# Altium project Joab da Silva Bezerra- PCEIoT.PrjPcb (part 1 of 2)
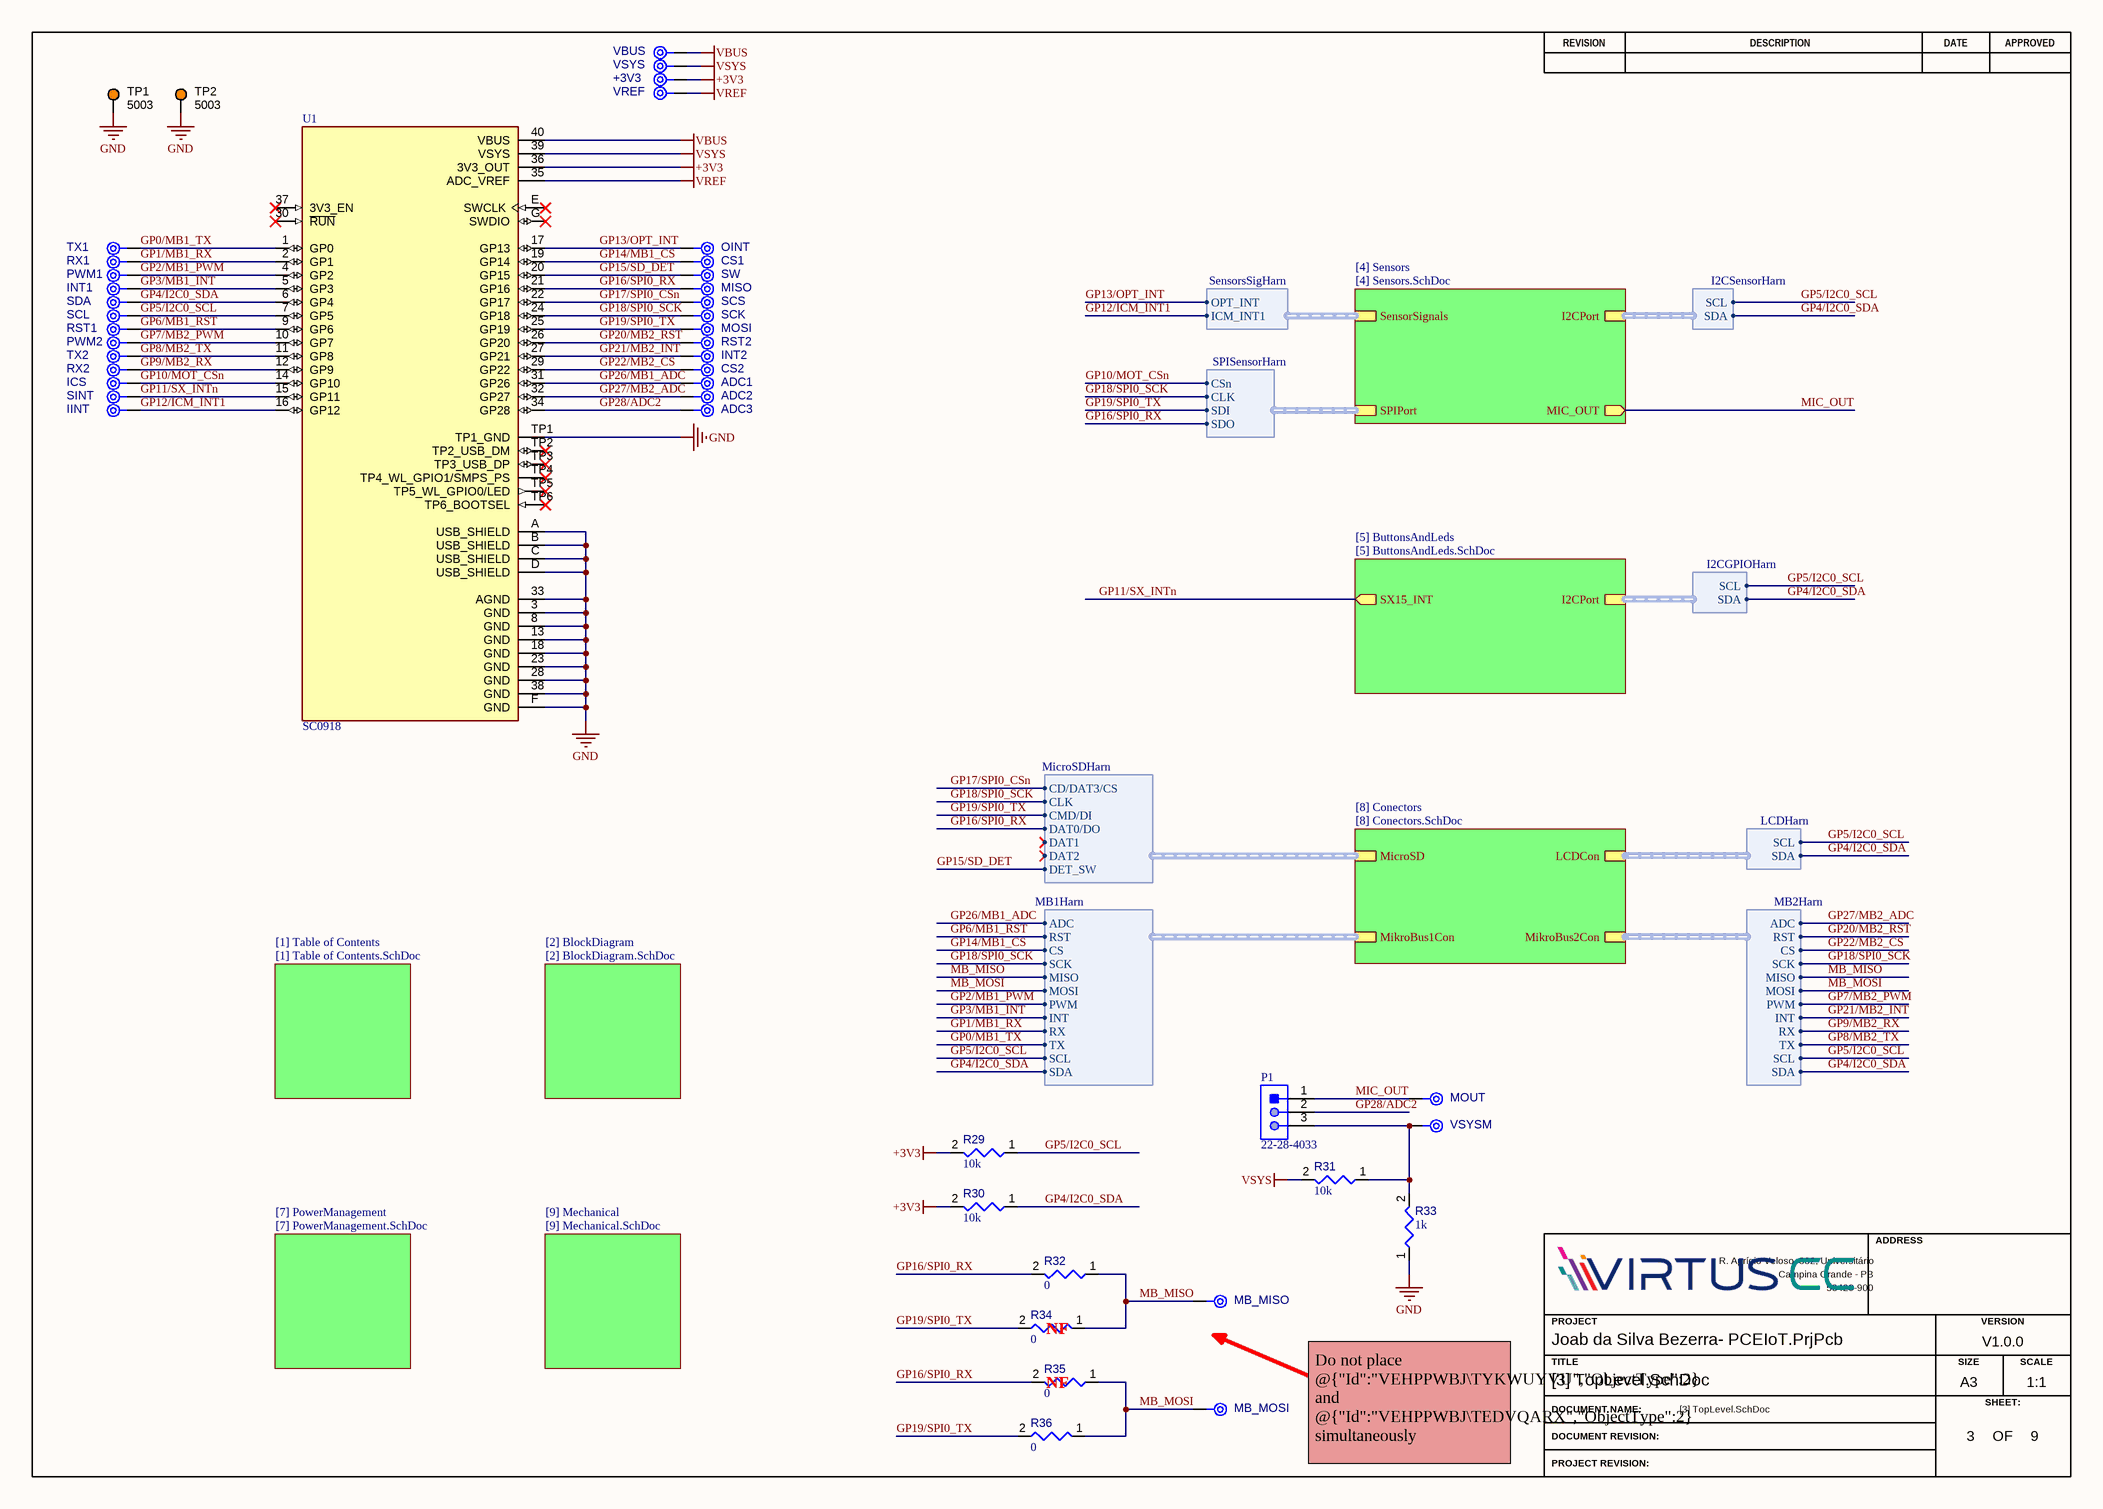
[diagram p0: [3] TopLevel.SchDoc]
Version: V1.0.0
9 sheets, 184 parts. Net scope: hierarchical (ports join the sheet entries above them; power ports are global).
Board file: PCB1.PcbDoc
Sheets:
  [3] TopLevel.SchDoc
    [1] Table of Contents = [1] Table of Contents.SchDoc
    [2] BlockDiagram = [2] BlockDiagram.SchDoc
    [7] PowerManagement = [7] PowerManagement.SchDoc
    [9] Mechanical = [9] Mechanical.SchDoc
    [4] Sensors = [4] Sensors.SchDoc
    [5] ButtonsAndLeds = [5] ButtonsAndLeds.SchDoc
      "RGB LED's"1 = [6] RgbLed.SchDoc
      "RGB LED's"2 = [6] RgbLed.SchDoc
      "RGB LED's"3 = [6] RgbLed.SchDoc
    [8] Conectors = [8] Conectors.SchDoc

## Sheet [3] TopLevel.SchDoc: =DocumentName
size A3; Organization: ORGANIZATION; Address1: R. Aprígio Veloso, 882, Universitário; Address2: Campina Grande - PB; Address3: 58429-900; DocumentNumber: 3; Revision: -; SheetNumber: 3; SheetTotal: 9; Project: Joab da Silva Bezerra- PCEIoT.PrjPcb; ENG_DATE: --/--/--; DSN_DATE: --/--/--; CHK_DATE: --/--/--; SCH_SCALE: 1:1

### Parts
+3V3  TPAD6R  [TP06R]  (value not drawn)  (no BOM)
ADC1  TPAD6R  [TP06R]  (value not drawn)  (no BOM)
ADC2  TPAD6R  [TP06R]  (value not drawn)  (no BOM)
ADC3  TPAD6R  [TP06R]  (value not drawn)  (no BOM)
CS1  TPAD6R  [TP06R]  (value not drawn)  (no BOM)
CS2  TPAD6R  [TP06R]  (value not drawn)  (no BOM)
ICS  TPAD6R  [TP06R]  (value not drawn)  (no BOM)
IINT  TPAD6R  [TP06R]  (value not drawn)  (no BOM)
INT1  TPAD6R  [TP06R]  (value not drawn)  (no BOM)
INT2  TPAD6R  [TP06R]  (value not drawn)  (no BOM)
MB_MISO  TPAD6R  [TP06R]  (value not drawn)  (no BOM)
MB_MOSI  TPAD6R  [TP06R]  (value not drawn)  (no BOM)
MISO  TPAD6R  [TP06R]  (value not drawn)  (no BOM)
MOSI  TPAD6R  [TP06R]  (value not drawn)  (no BOM)
MOUT  TPAD6R  [TP06R]  (value not drawn)  (no BOM)
OINT  TPAD6R  [TP06R]  (value not drawn)  (no BOM)
P1  22-28-4033  [MOLX-22-28-4033_V]
PWM1  TPAD6R  [TP06R]  (value not drawn)  (no BOM)
PWM2  TPAD6R  [TP06R]  (value not drawn)  (no BOM)
R29  value 10k  [RESC0603(1608)_L]  (hidden comment: Resistor 10k +/-1% 0603 100 mW)
R30  value 10k  [RESC0603(1608)_L]  (hidden comment: Resistor 10k +/-1% 0603 100 mW)
R31  value 10k  [RESC0603(1608)_L]  (hidden comment: Resistor 10k +/-1% 0603 100 mW)
R32  value 0  [RESC0603(1608)_L]  (hidden comment: Resistor 0R +/- 5% 0603 100 mW)
R33  value 1k  [RESC0603(1608)_L]  (hidden comment: Resistor 1k +/-1% 0603 100 mW)
R34  value 0  [RESC0603(1608)_L]  (hidden comment: Resistor 0R +/- 5% 0603 100 mW)
R35  value 0  [RESC0603(1608)_L]  (hidden comment: Resistor 0R +/- 5% 0603 100 mW)
R36  value 0  [RESC0603(1608)_L]  (hidden comment: Resistor 0R +/- 5% 0603 100 mW)
RST1  TPAD6R  [TP06R]  (value not drawn)  (no BOM)
RST2  TPAD6R  [TP06R]  (value not drawn)  (no BOM)
RX1  TPAD6R  [TP06R]  (value not drawn)  (no BOM)
RX2  TPAD6R  [TP06R]  (value not drawn)  (no BOM)
SCK  TPAD6R  [TP06R]  (value not drawn)  (no BOM)
SCL  TPAD6R  [TP06R]  (value not drawn)  (no BOM)
SCS  TPAD6R  [TP06R]  (value not drawn)  (no BOM)
SDA  TPAD6R  [TP06R]  (value not drawn)  (no BOM)
SINT  TPAD6R  [TP06R]  (value not drawn)  (no BOM)
SW  TPAD6R  [TP06R]  (value not drawn)  (no BOM)
TP1  5003  [KSTN-5003]
TP2  5003  [KSTN-5003]
TX1  TPAD6R  [TP06R]  (value not drawn)  (no BOM)
TX2  TPAD6R  [TP06R]  (value not drawn)  (no BOM)
U1  SC0918  [MODULE_SC0918]
VBUS  TPAD6R  [TP06R]  (value not drawn)  (no BOM)
VREF  TPAD6R  [TP06R]  (value not drawn)  (no BOM)
VSYS  TPAD6R  [TP06R]  (value not drawn)  (no BOM)
VSYSM  TPAD6R  [TP06R]  (value not drawn)  (no BOM)

### Sub-sheets
[1] Table of Contents = [1] Table of Contents.SchDoc: no entries
[2] BlockDiagram = [2] BlockDiagram.SchDoc: no entries
[4] Sensors = [4] Sensors.SchDoc: I2CPort (harness I2CSensorHarn), SPIPort (harness SPISensorHarn), SensorSignals (harness SensorsSigHarn), MIC_OUT (out)
[5] ButtonsAndLeds = [5] ButtonsAndLeds.SchDoc: SX15_INT (out), I2CPort (harness I2CGPIOHarn)
[7] PowerManagement = [7] PowerManagement.SchDoc: no entries
[8] Conectors = [8] Conectors.SchDoc: MikroBus1Con (harness MB1Harn), MicroSD (harness MicroSDHarn), MikroBus2Con (harness MB2Harn), LCDCon (harness LCDHarn)
[9] Mechanical = [9] Mechanical.SchDoc: no entries

### Harnesses
I2CSensorHarn: SCL, SDA
SPISensorHarn: CSn, CLK, SDI, SDO
SensorsSigHarn: OPT_INT, ICM_INT1
I2CGPIOHarn: SCL, SDA
LCDHarn: SCL, SDA
MicroSDHarn: CD/DAT3/CS, CLK, CMD/DI, DAT0/DO, DAT1, DAT2, DET_SW
MB1Harn: ADC, RST, CS, SCK, MISO, MOSI, PWM, INT, RX, TX, SCL, SDA
MB2Harn: ADC, RST, CS, SCK, MISO, MOSI, PWM, INT, RX, TX, SCL, SDA

### Nets
+3V3: +3V3.1(TP) R29.2 R30.2 U1.36(3V3_OUT)
GND: R33.1 TP1.1 TP2.1 U1.3(GND) U1.8(GND) U1.13(GND) U1.18(GND) U1.23(GND) U1.28(GND) U1.33(AGND) U1.38(GND) U1.A(USB_SHIELD) U1.B(USB_SHIELD) U1.C(USB_SHIELD) U1.D(USB_SHIELD) U1.F(GND) U1.TP1(TP1_GND)
VBUS: U1.40(VBUS) VBUS.1(TP)
VREF: U1.35(ADC_VREF) VREF.1(TP)
VSYS: R31.2 U1.39(VSYS) VSYS.1(TP)
GP0/MB1_TX: TX1.1(TP) U1.1(GP0) ; sheet [8] Conectors/MikroBus1Con.TX
GP1/MB1_RX: RX1.1(TP) U1.2(GP1) ; sheet [8] Conectors/MikroBus1Con.RX
GP2/MB1_PWM: PWM1.1(TP) U1.4(GP2) ; sheet [8] Conectors/MikroBus1Con.PWM
GP3/MB1_INT: INT1.1(TP) U1.5(GP3) ; sheet [8] Conectors/MikroBus1Con.INT
GP4/I2C0_SDA: R30.1 SDA.1(TP) U1.6(GP4) ; sheet [4] Sensors/I2CPort.SDA, sheet [5] ButtonsAndLeds/I2CPort.SDA, sheet [8] Conectors/LCDCon.SDA, sheet [8] Conectors/MikroBus1Con.SDA, sheet [8] Conectors/MikroBus2Con.SDA
GP5/I2C0_SCL: R29.1 SCL.1(TP) U1.7(GP5) ; sheet [4] Sensors/I2CPort.SCL, sheet [5] ButtonsAndLeds/I2CPort.SCL, sheet [8] Conectors/LCDCon.SCL, sheet [8] Conectors/MikroBus1Con.SCL, sheet [8] Conectors/MikroBus2Con.SCL
GP6/MB1_RST: RST1.1(TP) U1.9(GP6) ; sheet [8] Conectors/MikroBus1Con.RST
GP7/MB2_PWM: PWM2.1(TP) U1.10(GP7) ; sheet [8] Conectors/MikroBus2Con.PWM
GP8/MB2_TX: TX2.1(TP) U1.11(GP8) ; sheet [8] Conectors/MikroBus2Con.TX
GP9/MB2_RX: RX2.1(TP) U1.12(GP9) ; sheet [8] Conectors/MikroBus2Con.RX
GP10/MOT_CSn: ICS.1(TP) U1.14(GP10) ; sheet [4] Sensors/SPIPort.CSn
GP11/SX_INTn: SINT.1(TP) U1.15(GP11) ; sheet [5] ButtonsAndLeds/SX15_INT
GP12/ICM_INT1: IINT.1(TP) U1.16(GP12) ; sheet [4] Sensors/SensorSignals.ICM_INT1
GP13/OPT_INT: OINT.1(TP) U1.17(GP13) ; sheet [4] Sensors/SensorSignals.OPT_INT
GP14/MB1_CS: CS1.1(TP) U1.19(GP14) ; sheet [8] Conectors/MikroBus1Con.CS
GP15/SD_DET: SW.1(TP) U1.20(GP15) ; sheet [8] Conectors/MicroSD.DET_SW  [project net DET_SW]
GP16/SPI0_RX: MISO.1(TP) R32.2 R35.2 U1.21(GP16) ; sheet [4] Sensors/SPIPort.SDO, sheet [8] Conectors/MicroSD.DAT0/DO
GP17/SPI0_CSn: SCS.1(TP) U1.22(GP17) ; sheet [8] Conectors/MicroSD.CD/DAT3/CS  [project net CS]
GP18/SPI0_SCK: SCK.1(TP) U1.24(GP18) ; sheet [4] Sensors/SPIPort.CLK, sheet [8] Conectors/MicroSD.CLK, sheet [8] Conectors/MikroBus1Con.SCK, sheet [8] Conectors/MikroBus2Con.SCK
GP19/SPI0_TX: MOSI.1(TP) R34.2 R36.2 U1.25(GP19) ; sheet [4] Sensors/SPIPort.SDI, sheet [8] Conectors/MicroSD.CMD/DI
GP20/MB2_RST: RST2.1(TP) U1.26(GP20) ; sheet [8] Conectors/MikroBus2Con.RST
GP21/MB2_INT: INT2.1(TP) U1.27(GP21) ; sheet [8] Conectors/MikroBus2Con.INT
GP22/MB2_CS: CS2.1(TP) U1.29(GP22) ; sheet [8] Conectors/MikroBus2Con.CS
GP26/MB1_ADC: ADC1.1(TP) U1.31(GP26) ; sheet [8] Conectors/MikroBus1Con.ADC
GP27/MB2_ADC: ADC2.1(TP) U1.32(GP27) ; sheet [8] Conectors/MikroBus2Con.ADC
GP28/ADC2: ADC3.1(TP) P1.2 U1.34(GP28)
MB_MISO: MB_MISO.1(TP) R32.1 R34.1 ; sheet [8] Conectors/MikroBus1Con.MISO, sheet [8] Conectors/MikroBus2Con.MISO  [project net MB1_MISO]
MB_MOSI: MB_MOSI.1(TP) R35.1 R36.1 ; sheet [8] Conectors/MikroBus1Con.MOSI, sheet [8] Conectors/MikroBus2Con.MOSI  [project net MB1_MOSI]
MIC_OUT: MOUT.1(TP) P1.1 ; sheet [4] Sensors/MIC_OUT
NetP1_3: P1.3 R31.1 R33.2 VSYSM.1(TP)

Not connected (* = marked no-connect by the designer): U1 30(~{RUN})* 37(3V3_EN)* E(SWCLK)* G(SWDIO)* TP2(TP2_USB_DM)* TP3(TP3_USB_DP)* TP4(TP4_WL_GPIO1/SMPS_PS)* TP5(TP5_WL_GPIO0/LED)* TP6(TP6_BOOTSEL)*

### Notes on the sheet
- (near R34) NF
- (near R35) NF
- Do not place @{"Id":"VEHPPWBJ\TYKWUYVU","ObjectType":2} and @{"Id":"VEHPPWBJ\TEDVQARX","ObjectType":2}  simultaneously
  Do not place @{"Id":"VEHPPWBJ\RVHFYNCN","ObjectType":2} and @{"Id":"VEHPPWBJ\JGYLNFBT","ObjectType":2}  simultaneously
- REVISION
- DESCRIPTION
- DATE
- APPROVED
- ADDRESS
- PROJECT
- VERSION
- TITLE
- A3
- SIZE
- SCALE
- DOCUMENT NAME:
- DOCUMENT REVISION:
- OF
- SHEET:
- PROJECT REVISION:

### Library data of the parts
+3V3 ADC1-ADC3 CS1 CS2 ICS IINT INT1 INT2 MB_MISO MB_MOSI MISO MOSI MOUT OINT PWM1 PWM2 RST1 RST2 RX1 RX2 SCK SCL SCS SDA SINT SW TX1 TX2 VBUS VREF VSYS VSYSM = CMP-00028-00002-2: 0.6mm round; Pins: 1
P1 = CMP-002-00076-1: KK 254 Breakaway Header Vertical 3 Circuits 0.38um Gold Selective Plating Mating Pin 6.09mm; Pitch: 2.54mm; Number of Positions: 3; Contact Resistance: 20mR; Max Voltage Rating (AC): 250V; Current Rating: 4A; Gender: Male; Glow Wire Compliant: Non-compliant; RoHS Compliant: Yes; Contact Plating: Gold; Housing Color: Black; Housing Material: Nylon; Contact Mating Length: 0.24inch; Depth: 2.49mm; Number of Circuits: 3; Reach SVHC Compliant: Unknown; Packaging: Bulk; Max Voltage Rating (DC): 250V; Number of Rows: 1; Color: Black; Package Quantity: 1; Orientation: Straight; Number of Contacts: 3; Max Operating Temperature: 75°C; Mounting Technology: Through Hole; Min Operating Temperature: 0°C; Termination: Solder; Radiation Hardening: No; Series: KK® 42375; Contact Material: Brass,Bronze; Flammability Rating: UL94 V-0; Lead Free: Lead Free; Contact Type: Male Pin; Voltage Rating: 250V; Voltage Rating (DC): 250V
R29-R31 = CMP-009-00017-7: Chip Resistor, 10 KOhm, +/- 1%, 01 W, -55 to 155 degC, 0603 (1608 Metric); Power: 100mW; Voltage Rating: 50V; Mounting Technology: SM; Max Operating Temperature: 155°C; Case/Package: 0603; Tolerance: 1%; RoHS Compliant: True; Pins: 2; Min Operating Temperature: -55°C
R32 R34-R36 = CMP-009-00006-6: Chip Resistor, 0 Ohm, 0.1 W, -55 to 155 degC, 0603 (1608 Metric); Power: 100mW; Voltage Rating: 50V; Tolerance: 5%; Mounting Technology: SM; RoHS Compliant: True; Max Operating Temperature: 155°C; Min Operating Temperature: -55°C; Case/Package: 0603; Pins: 2
R33 = CMP-009-00014-6: Chip Resistor, 1 KOhm, +/-1%, 0.1 W, -55 to 155 degC, 0603 (1608 Metric); Power: 100mW; Tolerance: 1%; Voltage Rating: 50V; Mounting Technology: SM; Case/Package: 0603; Min Operating Temperature: -55°C; RoHS Compliant: True; Max Operating Temperature: 155°C; Pins: 2
TP1 TP2 = CMP-002-00037-2: Test Point, Orange, Height 4.6 mm, Tail Length 3 mm, 1-Pin THD, RoHS; Manufacturer: Keystone; Colour: Orange; Packaging: Bulk; Package Description: 1-Pin Through Hole Device, Dia 2.54 mm; Pins: 1; Package Reference: 5003; Datasheet Version: Jun-15; Case/Package: 5003; Mounting Technology: TH; Connector Type: TestPoint; Diameter: 2.54mm; Contact Material: Bronze; Datasheet URL: http://keyelco.com/userAssets/file/M65p56.pdf; Manufacturer URL: http://www.keyelco.com/; Package Quantity: 10; Contact Plating: Tin; RoHS Compliant: True
U1 = CMP-006-000001-6: Raspberry Pi Pico W RP2040; Pin Count: 53; MP: SC0918; Availability: In Stock; Source: SC0918.SchLib; Purchase-URL: https://pricing.snapeda.com/search/part/SC0918/?ref=eda; Price: None; MF: Raspberry Pi; Component Type: Standard; Design Item ID: SC0918; SnapEDA_Link: https://www.snapeda.com/parts/SC0918/Raspberry+Pi/view-part/?ref=snap; Check_prices: https://www.snapeda.com/parts/SC0918/Raspberry+Pi/view-part/?ref=eda; Value: *; Package: None; Manufacturer: Raspberry Pi; Manufacturer Part Number: SC0918; Component Type: Processors

## Sheet [1] Table of Contents.SchDoc: =DocumentName
size A3; Organization: ORGANIZATION; Address1: R. Aprígio Veloso, 882, Universitário; Address2: Campina Grande - PB; Address3: 58429-900; DocumentNumber: 1; Revision: -; SheetNumber: 1; SheetTotal: 9; Project: Joab da Silva Bezerra- PCEIoT.PrjPcb; ENG_DATE: --/--/--; DSN_DATE: --/--/--; CHK_DATE: --/--/--; SCH_SCALE: 1:1
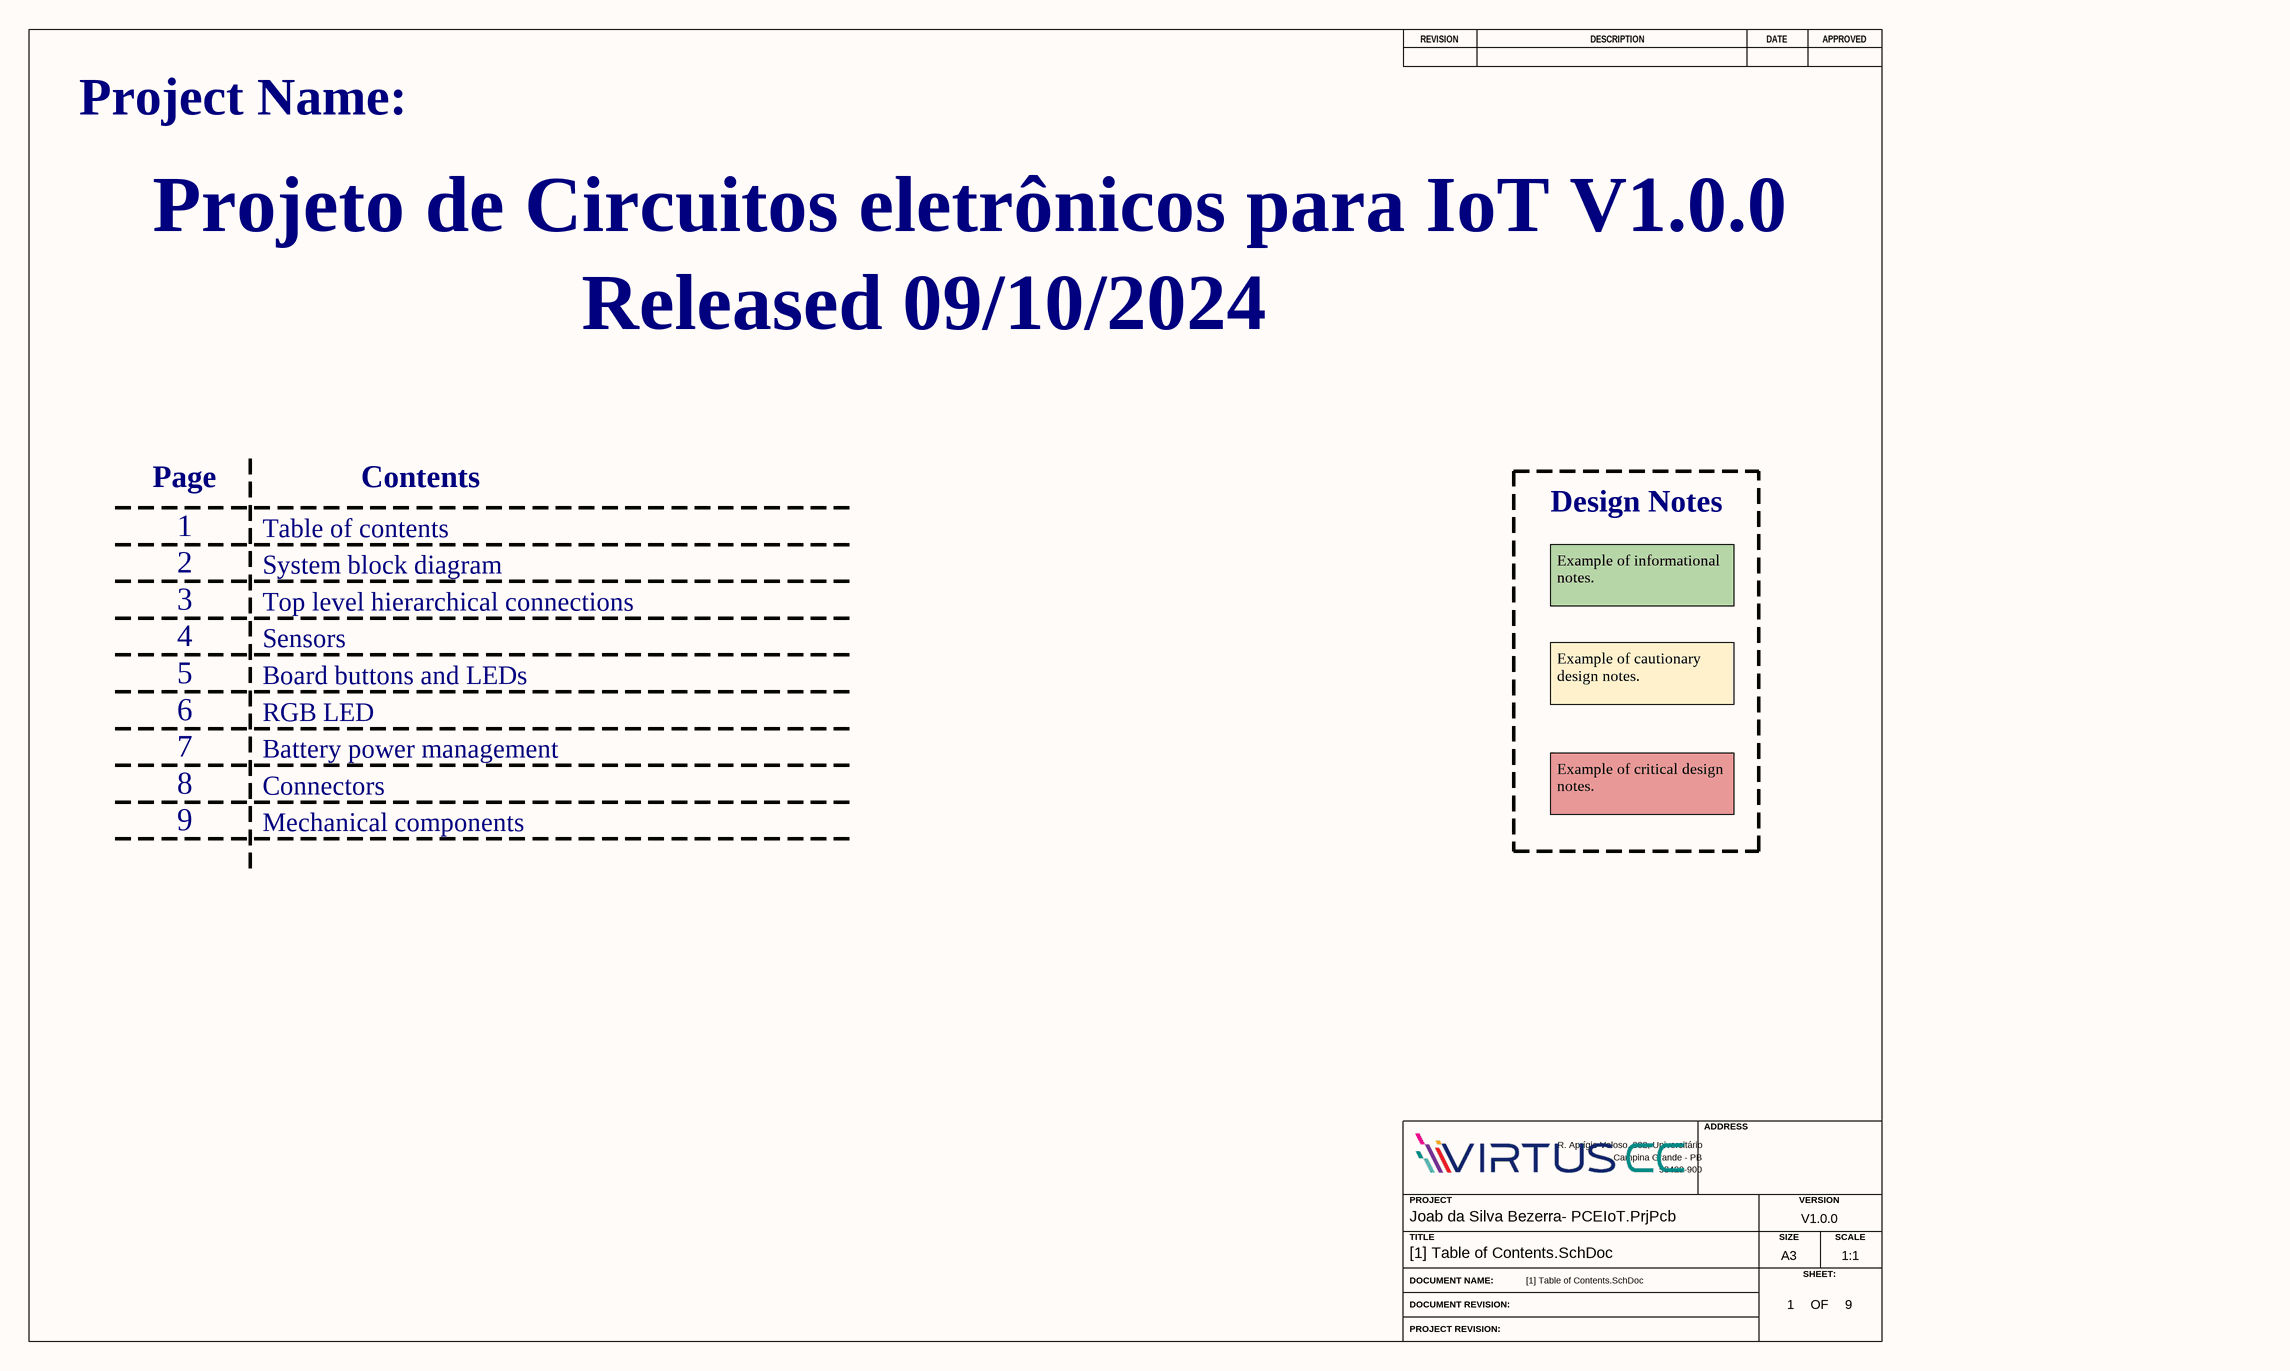
[diagram p1: [1] Table of Contents.SchDoc]

### Notes on the sheet
- Project Name:
- Projeto de Circuitos eletrônicos para IoT V1.0.0
- Released 09/10/2024
- Page
- Contents
- Design Notes
- 1
- 2
- Table of contents
- System block diagram
- 3
- 4
- Top level hierarchical connections
- Sensors
- Example of informational notes.
- 5
- Board buttons and LEDs
- Example of cautionary design notes.
- 6
- 7
- RGB LED
- Battery power management
- 8
- 9
- Connectors
- Mechanical components
- Example of critical design notes.
- REVISION
- DESCRIPTION
- DATE
- APPROVED
- ADDRESS
- PROJECT
- VERSION
- TITLE
- A3
- SIZE
- SCALE
- DOCUMENT NAME:
- DOCUMENT REVISION:
- OF
- SHEET:
- PROJECT REVISION:

## Sheet [2] BlockDiagram.SchDoc: =DocumentName
size A3; Organization: ORGANIZATION; Address1: R. Aprígio Veloso, 882, Universitário; Address2: Campina Grande - PB; Address3: 58429-900; DocumentNumber: 2; Revision: -; SheetNumber: 2; SheetTotal: 9; Project: Joab da Silva Bezerra- PCEIoT.PrjPcb; ENG_DATE: --/--/--; DSN_DATE: --/--/--; CHK_DATE: --/--/--; SCH_SCALE: 1:1
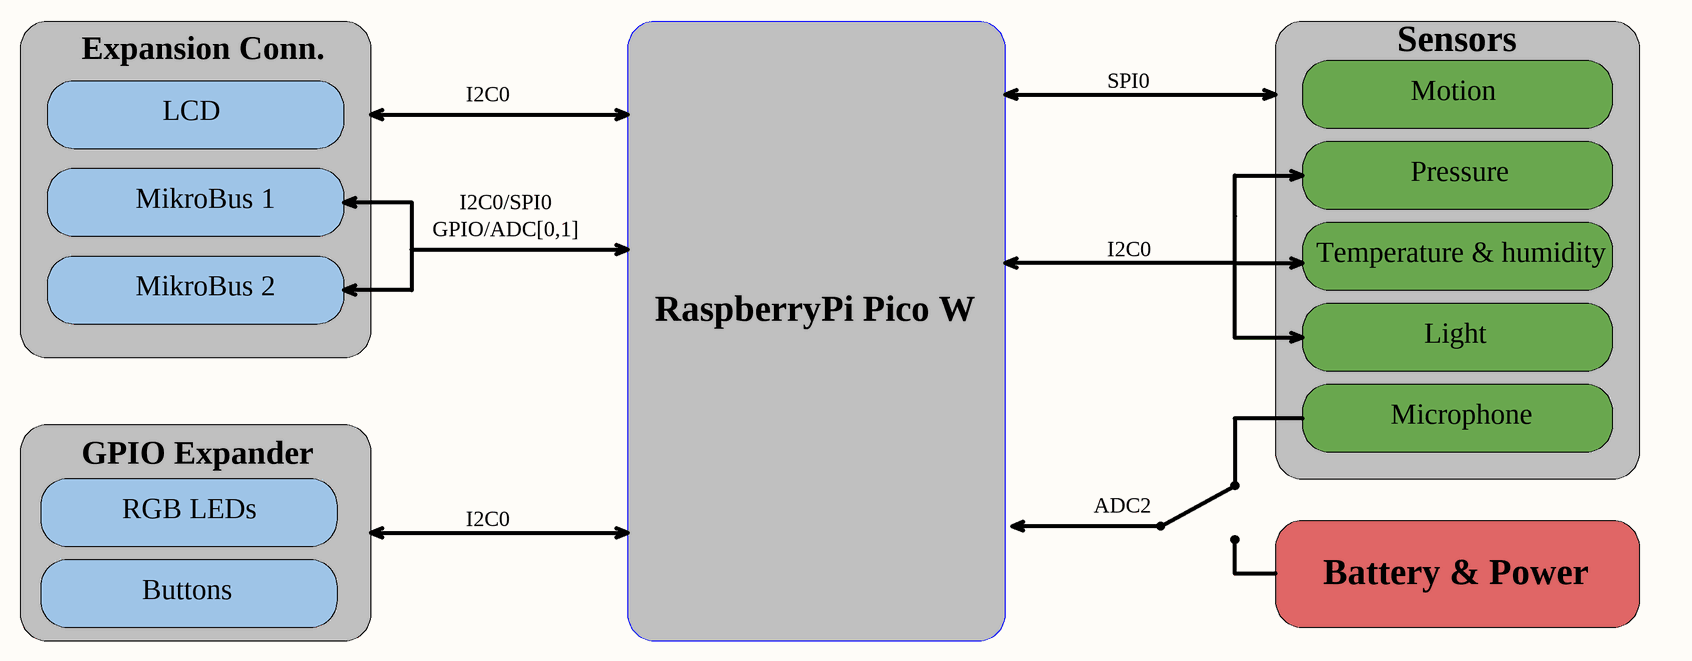
[diagram p2: [2] BlockDiagram.SchDoc]

### Notes on the sheet
- Expansion Conn.
- I2C0
- SPI0
- Sensors
- Motion
- LCD
- MikroBus 1
- GPIO/ADC[0,1]
- I2C0/SPI0
- Pressure
- MikroBus 2
- Temperature & humidity
- RaspberryPi Pico W
- Light
- Microphone
- GPIO Expander
- RGB LEDs
- ADC2
- Buttons
- Battery & Power
- REVISION
- DESCRIPTION
- DATE
- APPROVED
- ADDRESS
- PROJECT
- VERSION
- TITLE
- A3
- SIZE
- SCALE
- DOCUMENT NAME:
- DOCUMENT REVISION:
- OF
- SHEET:
- PROJECT REVISION:

## Sheet [7] PowerManagement.SchDoc: =DocumentName
size A3; Organization: ORGANIZATION; Address1: R. Aprígio Veloso, 882, Universitário; Address2: Campina Grande - PB; Address3: 58429-900; DocumentNumber: 7; Revision: -; SheetNumber: 7; SheetTotal: 9; Project: Joab da Silva Bezerra- PCEIoT.PrjPcb; ENG_DATE: --/--/--; DSN_DATE: --/--/--; CHK_DATE: --/--/--; SCH_SCALE: 1:1
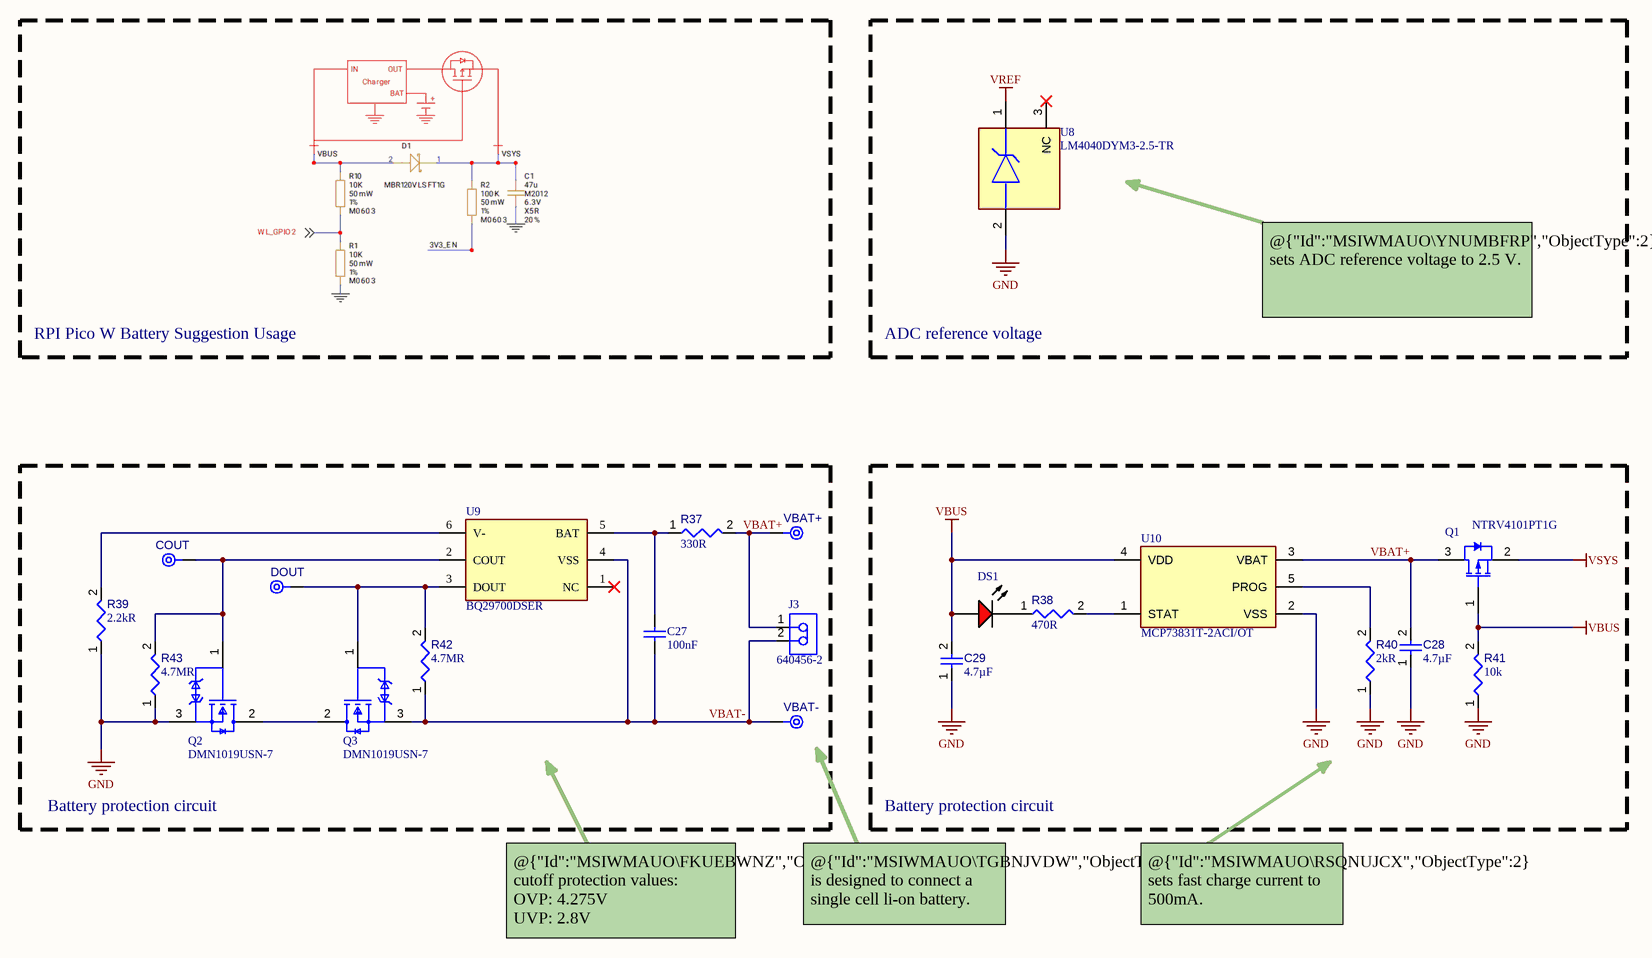
[diagram p3: [7] PowerManagement.SchDoc]

### Parts
C27  value 100nF  [CAPC0603(1608)100_L]  (hidden comment: VJ0603Y104MXJCW1BC)
C28  value 4.7µF  [CAPC0603(1608)100_L]  (hidden comment: Capacitor 4.7µF +/-20% 10V 0603)
C29  value 4.7µF  [CAPC0603(1608)100_L]  (hidden comment: Capacitor 4.7µF +/-20% 10V 0603)
COUT  TPAD6R  [TP06R]  (value not drawn)  (no BOM)
DOUT  TPAD6R  [TP06R]  (value not drawn)  (no BOM)
DS1  19-217/R6C-AL1M2VY/3T  [EVRL-0603-2_V]  (value not drawn)
J3  640456-2  [TECO-640456-2_V]
Q1  NTRV4101PT1G  [ONSC-SOT-23-3-318-08_V]
Q2  DMN1019USN-7  [FP-SC59-MFG]
Q3  DMN1019USN-7  [FP-SC59-MFG]
R37  value 330R  [RESC0603(1608)_L]  (hidden comment: ERJ-3EKF3300V)
R38  value 470R  [RESC0603(1608)_L]  (hidden comment: CRCW0603470RJNEA)
R39  value 2.2kR  [RESC0603(1608)_L]  (hidden comment: CRCW06032K20FKEA)
R40  value 2kR  [RESC0603(1608)_L]  (hidden comment: ERJ-3EKF2001V)
R41  value 10k  [RESC0603(1608)_L]  (hidden comment: Resistor 10k +/-1% 0603 100 mW)
R42  value 4.7MR  [RESC0603(1608)_L]  (hidden comment: ERJ-3GEYJ475V)
R43  value 4.7MR  [RESC0603(1608)_L]  (hidden comment: ERJ-3GEYJ475V)
U8  LM4040DYM3-2.5-TR  [FP-SOT23-3LD-PL-1-IPC_A]
U9  BQ29700DSER  [FP-DSE0006A-MFG]
U10  MCP73831T-2ACI/OT  [FP-C04-091-OT-MFG]
VBAT+  TPAD6R  [TP06R]  (value not drawn)  (no BOM)
VBAT-  TPAD6R  [TP06R]  (value not drawn)  (no BOM)

### Blocks framed on the sheet
ADC reference voltage: U8

### Nets
GND: C28.1 C29.1 Q2.3(D) R39.1 R40.1 R41.1 R43.1 U8.2(-) U10.2(VSS)
VBUS: C29.2 DS1.1(A) Q1.1(G) R41.2 U10.4(VDD)
VREF: U8.1(+)
VSYS: Q1.2(S)
VBAT+: C28.2 J3.1 Q1.3(D) R37.2 U10.3(VBAT) VBAT+.1(TP)
VBAT-: C27.1 J3.2 Q3.3(D) R42.1 U9.4(VSS) VBAT-.1(TP)
NetC27_2: C27.2 R37.1 U9.5(BAT)
NetCOUT_1: COUT.1(TP) Q2.1(G) R43.2 U9.2(COUT)
NetDOUT_1: DOUT.1(TP) Q3.1(G) R42.2 U9.3(DOUT)
NetDS1_2: DS1.2(K) R38.1
NetQ2_2: Q2.2(S) Q3.2(S)
NetR38_2: R38.2 U10.1(STAT)
NetR39_2: R39.2 U9.6(V-)
NetR40_2: R40.2 U10.5(PROG)

Not connected (* = marked no-connect by the designer): U8 3(NC)*; U9 1(NC)*

### Notes on the sheet
- RPI Pico W Battery Suggestion Usage
- @{"Id":"MSIWMAUO\YNUMBFRP","ObjectType":2} sets ADC reference voltage to 2.5 V.
- Battery protection circuit
- @{"Id":"MSIWMAUO\FKUEBWNZ","ObjectType":2}  cutoff protection values:
  OVP: 4.275V
  UVP: 2.8V
- @{"Id":"MSIWMAUO\TGBNJVDW","ObjectType":2} is designed to connect a single cell li-on battery.
- @{"Id":"MSIWMAUO\RSQNUJCX","ObjectType":2} sets fast charge current to 500mA.
- REVISION
- DESCRIPTION
- DATE
- APPROVED
- ADDRESS
- PROJECT
- VERSION
- TITLE
- A3
- SIZE
- SCALE
- DOCUMENT NAME:
- DOCUMENT REVISION:
- OF
- SHEET:
- PROJECT REVISION:

### Library data of the parts
C27 = CMP-001-00085-1: Multilayer Ceramic Capacitor, 0.1 uF, 16 V, ± 20%, X7R, 0603 [1608 Metric]; Dielectric Material: Tantalum; Voltage Rating: 16V; Packaging: Tape and Reel; Min Operating Temperature: -55°C; Case/Package: 0603; Length: 1.6mm; Termination: SMD/SMT; Height: 0.95mm; Mounting Technology: Surface Mount; Width: 0.8mm; Case Code (Imperial): 0603; Construction: Flat; Lead Free: Lead Free; Package Quantity: 4000; Max Operating Temperature: 125°C; Dielectric: X7R; RoHS Compliant: Yes; Depth: 0.8mm; Tolerance: 20%; Series: VJ; Case Code (Metric): 1608; Voltage Rating (DC): 16V
C28 C29 = CMP-001-00076-4: Chip Capacitor, 4.7µF +/-20%, 10V, 0603, Thickness 1 mm; Tolerance: 10%; Mounting Technology: SMT; Case/Package: 0603; Pins: 2; Min Operating Temperature: -55°C; Max Operating Temperature: 85°C; Voltage Rating: 10V
COUT DOUT VBAT+ VBAT- = CMP-00028-00002-2: 0.6mm round; Pins: 1
DS1 = CMP-007-00004-2: Chip LED, Red, 5 V, 25 mA, -40 to 85 degC, 2-Pin SMD (0603), RoHS, Tape and Reel; Manufacturer: Everlight Electronics; Forward Voltage: 2.2V; Lens Style: Clear; Package Reference: 0603; Datasheet Version: Rev. 1, 01/2005; Mounting Technology: SM; RoHS Compliant: False; Datasheet URL: https://datasheet.ciiva.com/4688/el-19-217-r6c-al1m2vy-3tpdf-187026-4688713.pdf; Case/Package: 0603; Colour: Red; Manufacturer URL: http://www.everlight.com/; Package Description: 2-Pin Surface Mount Device, Body 1.6 x 0.8 mm
J3 = CMP-002-00073-1: Connector 250V AC/DC 5A 2P 1 Row PCB - Vertical Mounting Polyester White; Contact Retention: No (Without); PCB Thickness: 0.063inch; Approvals: CSA; Contact Post Length: 3.56mm; Gender: Male; Circuit Application: Signal; Tail Length: 0.14inch; Plating Thickness: 3.81um; Plating: Tin; Mating Connector Lock: Yes (With); PCB Mount Retention: Without; Contact Style: Straight; Number of Positions: 2; Connector System: Wire-to-Board; Pitch: 2.54mm; Connector Type: Connector,Pin,Plug,Header; Voltage Rating: 250V; Termination: Solder; Contact Current Rating: 5A; PCB Mount Alignment: No (Without); Housing Material: Polyester; Contact Material: Copper Alloy; Current Rating: 5A; Mounting Ears: No (Without); Strain Relief: No (Without); Shrouded: No (Without); Min Operating Temperature: -67°C; Orientation: Straight; Series: MTA-100; Panel Mount Retention: No (Without); Package Quantity: 5000; Height: 7.87mm; Length: 7.62mm; PCB Mounting Orientation: Vertical; Flammability Rating: UL94 V-0; Operating Supply Voltage: 250V; Contact Plating: Tin; Mounting Technology: Through Hole; Voltage Rating (AC): 250V; Backwall/Post Interruptions: No (Without); Contact Mating Length: 7.49mm; Color: Beige; Voltage Rating (DC): 250V; Lead Free: Lead Free; Reach SVHC Compliant: Unknown; Sealable: No (Without); Mating Alignment: No (Without); Mating Retention: No (Without); Number of Contacts: 2; Contact Shape: Square; Max Operating Temperature: 221°C; Number of Rows: 1; RoHS Compliant: Yes; Housing Color: Natural
Q1 = CMP-013-00034-1: NTRV4101PT1G P-channel MOSFET Transistor; 1.7 A; 20 V; 3-Pin SOT-23; Gate to Source Voltage (Vgs): 8V; Continuous Drain Current (ID): 3.2A; Input Capacitance: 675pF; Turn-On Delay Time: 7.5ns; Rds On Max: 85mR; Power Dissipation: 1.25W; Rise Time: 12.6ns; Max Power Dissipation: 420mW; Drain to Source Resistance: 70mR; Element Configuration: Single; Turn-Off Delay Time: 30.2ns; Fall Time: 21ns; Drain to Source Voltage (Vdss): 20V; Number of Elements: 1; Case/Package: SOT-23-3; RoHS Compliant: Yes; Polarity: P-CHANNEL; Height: 1.01mm; Packaging: Tape and Reel; Series: -; Package Quantity: 3000; Max Operating Temperature: 150°C; Length: 3.04mm; Lead Free: Lead Free; Pins: 3; Radiation Hardening: No; Width: 1.4mm; Min Operating Temperature: -55°C
Q2 Q3 = CMP-013-00035-1: N-Channel 12 V 10 mO 50.6 nC SMT Enhancement Mode Mosfet - SC-59 (SOT-23); Gate to Source Voltage (Vgs): 4.5V; Max Power Dissipation: 680mW; Number of Channels: 1; Rds On Max: 10mR; Input Capacitance: 2.426nF; Turn-On Delay Time: 7.6ns; Value: 2.426E-09F; Rise Time: 57.6ns; Fall Time: 16.8ns; Drain to Source Resistance: 41mR; Turn-Off Delay Time: 22.2ns; Continuous Drain Current (ID): 9.3A; Drain to Source Voltage (Vdss): 12V; RoHS Compliant: Yes; Min Operating Temperature: -55°C; Series: -; Max Operating Temperature: 150°C; Lead Free: Lead Free; Weight: 0.000282oz; Package Quantity: 3000; Polarity: N-CHANNEL; Packaging: Tape and Reel; Case/Package: TO-236-3; Mounting Technology: Surface Mount
R37 = CMP-009-00184-1: SMD Chip Resistor, 330 Ohm, ± 1%, 100 mW, 0603 [1608 Metric], Thick Film, Precision; Current Rating: 500mA; Voltage Rating (DC): 75V; Power Rating: 100mW; Gender: Male; Temperature Coefficient: 100ppm/°C; Termination: SMD/SMT; Construction: Rectangular; Contact Plating: Tin; Resistor Type: Thick Film; Features: Automotive AEC-Q200; Max Operating Temperature: 155°C; Weight: 7.1E-05oz; Package Quantity: 5000; Lead Pitch: 1.1mm; Radiation Hardening: No; Lead Free: Lead Free; Min Operating Temperature: -55°C; Reach SVHC Compliant: No; Pins: 2; Number of Terminations: 2; Width: 0.8mm; RoHS Compliant: Yes; Depth: 0.8mm; Packaging: Tape and Reel; Voltage Rating: 75V; Mounting Technology: Surface Mount; Case Code (Metric): 1608; Resistance Tolerance: 1%; Tolerance: 1%; Case Code (Imperial): 0603; Length: 1.6mm; Height: 0.45mm; Military Standard: Not; Series: ERJ; Max Power Dissipation: 100mW; Case/Package: 0603; Contact Material: Copper
R38 = CMP-009-00182-1: Res Thick Film 0603 470 Ohm 5% 0.1W(1/10W) ±200ppm/°C Pad SMD Automotive T/R; Max Power Dissipation: 100mW; Working Voltage: 75V; Case Code (Metric): 1608; Case Code (Imperial): 0603; Width: 0.85mm; Series: CRCW; Max Operating Temperature: 155°C; Features: Automotive AEC-Q200; Height: 0.45mm; Technology: THICK FILM; Power Rating: 100mW; Depth: 0.85mm; Min Operating Temperature: -55°C; Weight: 7.1E-05oz; RoHS Compliant: Yes; Number of Terminations: 2; Voltage Rating: 75V; Ratings: AEC-Q200; Case/Package: 0603; Contact Plating: Tin; Radiation Hardening: No; Termination: SMD/SMT; Tolerance: 5%; Construction: Rectangular; Package Quantity: 5000; Reach SVHC Compliant: Unknown; Length: 1.55mm; Resistor Type: Thick Film; Lead Free: Lead Free; Temperature Coefficient: 200ppm/°C; Resistance Tolerance: 5%; Packaging: Tape and Reel; Military Standard: Not
R39 = CMP-009-00186-1: SMD Chip Resistor, 2.2 kOhm, ± 1%, 100 mW, 0603 [1608 Metric], Thick Film, General Purpose; Voltage Rating (DC): 75V; Max Power Dissipation: 100mW; Temperature Coefficient: 100ppm/°C; Depth: 0.85mm; Height: 0.45mm; Contact Plating: Tin; Resistance Tolerance: 1%; Ratings: AEC-Q200; Weight: 7.1E-05oz; Series: CRCW; Case Code (Imperial): 0603; Construction: Rectangular; Width: 0.033inch; Reach SVHC Compliant: Unknown; Case Code (Metric): 1608; Resistor Type: Thick Film; Packaging: Tape and Reel; Case/Package: 0603; Package Quantity: 10; RoHS Compliant: Yes; Lead Free: Lead Free; Military Standard: Not; Termination: SMD/SMT; Tolerance: 1%; Technology: THICK FILM; Max Operating Temperature: 155°C; Voltage Rating: 75V; Power Rating: 100mW; Length: 1.55mm; Number of Terminations: 2; Radiation Hardening: No; Min Operating Temperature: -55°C; Features: Automotive AEC-Q200
R40 = CMP-009-00181-1: SMD Chip Resistor, 2 kOhm, ï¿½ 1%, 100 mW, 0603 [1608 Metric], Thick Film, Precision; Power Rating: 100mW; Temperature Coefficient: 100ppm/°C; Voltage Rating: 75V; Voltage Rating (DC): 50V; Construction: Rectangular; Tolerance: 1%; Case Code (Imperial): 0603; Contact Plating: Tin; Packaging: Tape and Reel; Width: 0.8mm; Length: 1.6mm; Lead Free: Lead Free; Max Operating Temperature: 155°C; Number of Terminations: 2; Features: Automotive AEC-Q200; Min Operating Temperature: -55°C; Termination: SMD/SMT; Case/Package: 0603; Max Power Dissipation: 100mW; Reach SVHC Compliant: No; Radiation Hardening: No; RoHS Compliant: Yes; Resistance Tolerance: 1%; Pins: 2; Series: ERJ; Case Code (Metric): 1608; Mounting Technology: Surface Mount; Height: 0.022inch; Military Standard: Not; Depth: 0.8mm; Package Quantity: 1; Resistor Type: Thick Film
R41 = CMP-009-00017-7: as R29 on sheet [3] TopLevel; Mounting Technology: SM; Max Operating Temperature: 155°C; Case/Package: 0603; Tolerance: 1%; RoHS Compliant: True; Pins: 2; Min Operating Temperature: -55°C
R42 R43 = CMP-009-00185-1: Res Thick Film 0603 4.7M Ohm 5% 0.1W -400ppm/°C to 150ppm/°C Molded SMD Punched Carrier T/R; Voltage Rating (DC): 50V; Max Power Dissipation: 100mW; Voltage Rating: 75V; Min Operating Temperature: -55°C; Reach SVHC Compliant: Unknown; Resistance Tolerance: 5%; Contact Plating: Tin; Military Standard: Not; RoHS Compliant: Yes; Tolerance: 5%; Depth: 0.8mm; Case/Package: 0603; Number of Terminations: 2; Width: 0.8mm; Lead Free: Lead Free; Case Code (Metric): 1608; Construction: Rectangular; Series: ERJ; Features: Automotive AEC-Q200; Length: 1.6mm; Power Rating: 100mW; Weight: 7.1E-05oz; Termination: SMD/SMT; Height: 0.45mm; Resistor Type: Thick Film; Case Code (Imperial): 0603; Packaging: Tape and Reel; Mounting Technology: Surface Mount; Temperature Coefficient: 150ppm/°C; Package Quantity: 1; Technology: THICK FILM; Max Operating Temperature: 155°C
U8 = CMP-004-00033-1: LM4040 Series 2.5 V ±1 % Precision Micropower Shunt Voltage Reference - SOT-23; Max Output Voltage: 2.5V; Output Type: Fixed; Output Voltage: 10V; Cathode Current: 70uA; Temperature Coefficient: 150ppm/°C; Output Current: 15mA; Tolerance: 1%; Supply Current: 500nA; Max Operating Temperature: 85°C; Series: -; Min Output Voltage: 2.5V; Length: 2.92mm; Current Rating: 15mA; Pins: 3; Height: 1.01mm; Package Quantity: 3000; Max Output current: 15mA; Min Operating Temperature: -40°C; Packaging: Tape and Reel; Width: 1.3mm; Radiation Hardening: No; Case/Package: SOT-23; Reach SVHC Compliant: No; Reference Voltage: 2.5V; Lead Free: Lead Free; RoHS Compliant: Yes; Reference Type: Shunt; Mounting Technology: Surface Mount
U9 = CMP-001-0002-1: Li-Ion/Li Polymer Advanced Single-Cell Battery Protector IC Family 6-WSON -40 to 85; Fault Protection: Over Current,Short Circuit,Over/Under Voltage; Operating Supply Voltage: 8V; Number of Cells: 1; Case/Package: WFDFN; Lead Free: Lead Free; Pins: 6; Height: 800um; Packaging: Tape and Reel; Max Operating Temperature: 85°C; Weight: 0.000342oz; Mounting Technology: Surface Mount; Series: -; Contact Plating: Gold; Thickness: 750um; RoHS Compliant: Yes; Package Quantity: 3000; Width: 1.5mm; Length: 1.5mm; Min Operating Temperature: -40°C
U10 = CMP-001-0001-1: MCP73831 Series Single-Cell Li-Ion/Li-Polymer Battery Charge Controller SOT-23-5; Output Voltage: 4.2V; Number of Channels: 1; Fault Protection: Over Voltage; Min Supply Voltage: 3.75V; Max Supply Voltage: 6V; Max Power Dissipation: 1.54W; Output Current: 500mA; Voltage Rating: 4.534V; Drain to Source Resistance: 350mR; Min Output Voltage: 4.168V; Max Output Voltage: 4.5V; Mounting Technology: Surface Mount; Number of Outputs: 1; RoHS Compliant: Yes; Weight: 0.00709oz; Length: 3.1mm; Max Operating Temperature: 85°C; Series: -; Case/Package: SOT-23; Radiation Hardening: No; Pins: 5; Packaging: Tape and Reel; Lead Free: Lead Free; Number of Cells: 1; Width: 1.8mm; Height: 1.3mm; Max Charge Current: 500mA; Battery Pack Voltage: 4.2V; Reach SVHC Compliant: No; Termination: SMD/SMT; Min Operating Temperature: -40°C

## Sheet [9] Mechanical.SchDoc: =DocumentName
size A3; Organization: ORGANIZATION; Address1: R. Aprígio Veloso, 882, Universitário; Address2: Campina Grande - PB; Address3: 58429-900; DocumentNumber: 9; Revision: -; SheetNumber: 9; SheetTotal: 9; Project: Joab da Silva Bezerra- PCEIoT.PrjPcb; ENG_DATE: --/--/--; DSN_DATE: --/--/--; CHK_DATE: --/--/--; SCH_SCALE: 1:1
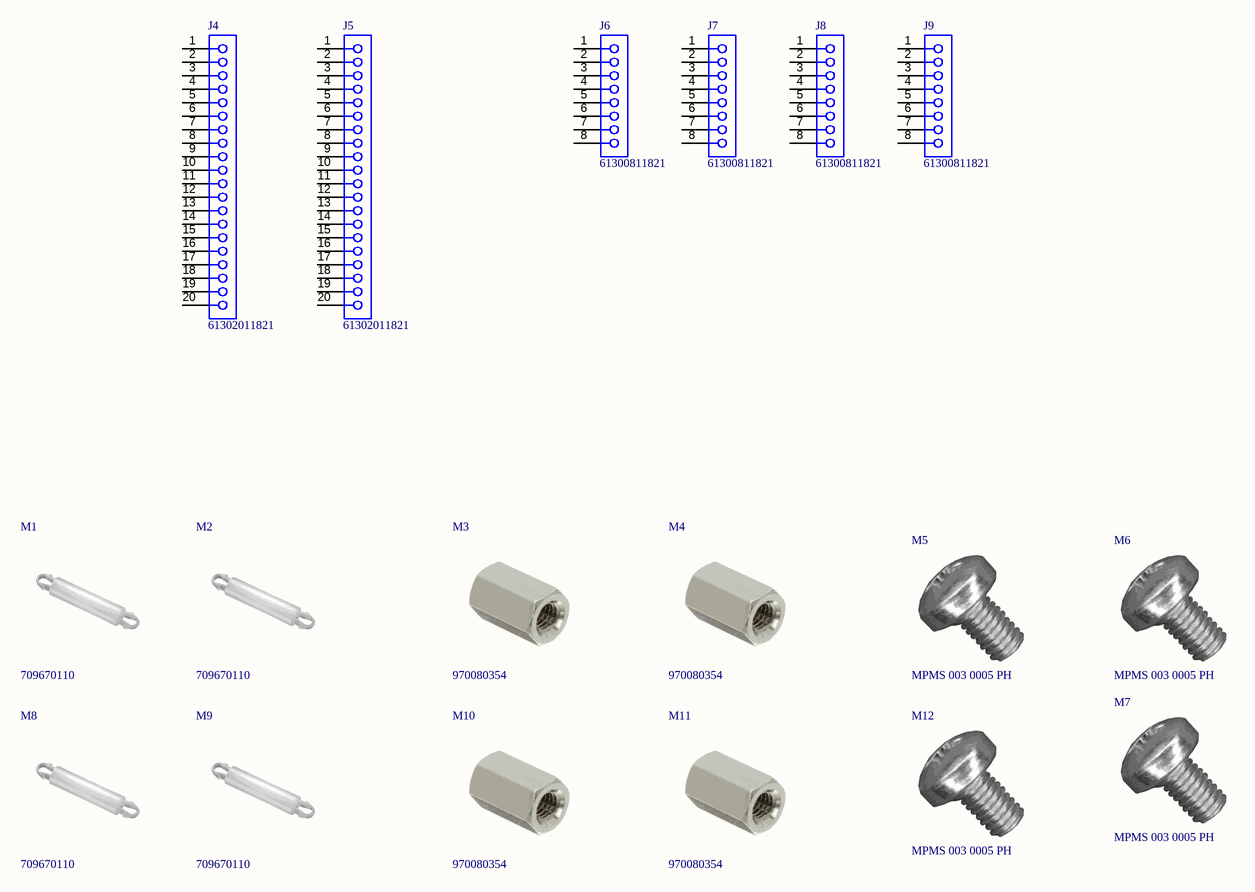
[diagram p4: [9] Mechanical.SchDoc]

### Parts
J4  61302011821  [61302011821]  (mechanical)
J5  61302011821  [61302011821]  (mechanical)
J6  61300811821  [61300811821]  (mechanical)
J7  61300811821  [61300811821]  (mechanical)
J8  61300811821  [61300811821]  (mechanical)
J9  61300811821  [61300811821]  (mechanical)
M1  709670110  (mechanical)
M2  709670110  (mechanical)
M3  970080354  (mechanical)
M4  970080354  (mechanical)
M5  MPMS 003 0005 PH  (mechanical)
M6  MPMS 003 0005 PH  (mechanical)
M7  MPMS 003 0005 PH  (mechanical)
M8  709670110  (mechanical)
M9  709670110  (mechanical)
M10  970080354  (mechanical)
M11  970080354  (mechanical)
M12  MPMS 003 0005 PH  (mechanical)

### Nets

Not connected (* = marked no-connect by the designer): J4 1 2 3 4 5 6 7 8 9 10 11 12 13 14 15 16 17 18 19 20; J5 1 2 3 4 5 6 7 8 9 10 11 12 13 14 15 16 17 18 19 20; J6 1 2 3 4 5 6 7 8; J7 1 2 3 4 5 6 7 8; J8 1 2 3 4 5 6 7 8; J9 1 2 3 4 5 6 7 8

### Notes on the sheet
- REVISION
- DESCRIPTION
- DATE
- APPROVED
- ADDRESS
- PROJECT
- VERSION
- TITLE
- A3
- SIZE
- SCALE
- DOCUMENT NAME:
- DOCUMENT REVISION:
- OF
- SHEET:
- PROJECT REVISION:

### Library data of the parts
J4 J5 = CMP-002-00074-1: THT Vertical Socket Header WR-PHD, Pitch 2.54 mm, Single Row, 20 pins; Contact Resistance: 20mR; Operating Supply Voltage: 250V; Current Rating: 3A; Gender: Female; Orientation: Vertical; Pins: 20; Lead Pitch: 2.54mm; RoHS Compliant: Yes
J6-J9 = CMP-002-00075-1: Btb Conn, Rcpt, 8Pos, 1Row, 2.54Mm Rohs Compliant: Yes; Operating Supply Voltage: 250V; Gender: Female; Contact Resistance: 20mR; Current Rating: 3A; Pins: 8; Lead Pitch: 2.54mm; Orientation: Vertical; RoHS Compliant: Yes
M1 M2 M8 M9 = CMP-00028-00009-2: Pcb Mounting, Nylon 6.6, 11Mm Rohs Compliant: Yes; Material: Nylon; Series: WA-SNSN
M3 M4 M10 M11 = CMP-00028-00008-4: WA-SBRII Brass Spacer Stud Metric Thread int./int.; Gender: Female, Female; Threaded/Unthreaded: Threaded; Thread Size: M3; Plating: Nickel; Series: WA-SBRII; Color: Silver; Material: Brass
M5-M7 M12 = CMP-00028-00007-2: Mach Screw Pan Head Phillips M3; Lead Free: Contains Lead

## Sheet [4] Sensors.SchDoc: =DocumentName
size A3; Organization: ORGANIZATION; Address1: R. Aprígio Veloso, 882, Universitário; Address2: Campina Grande - PB; Address3: 58429-900; DocumentNumber: 4; Revision: -; SheetNumber: 4; SheetTotal: 9; Project: Joab da Silva Bezerra- PCEIoT.PrjPcb; ENG_DATE: --/--/--; DSN_DATE: --/--/--; CHK_DATE: --/--/--; SCH_SCALE: 1:1
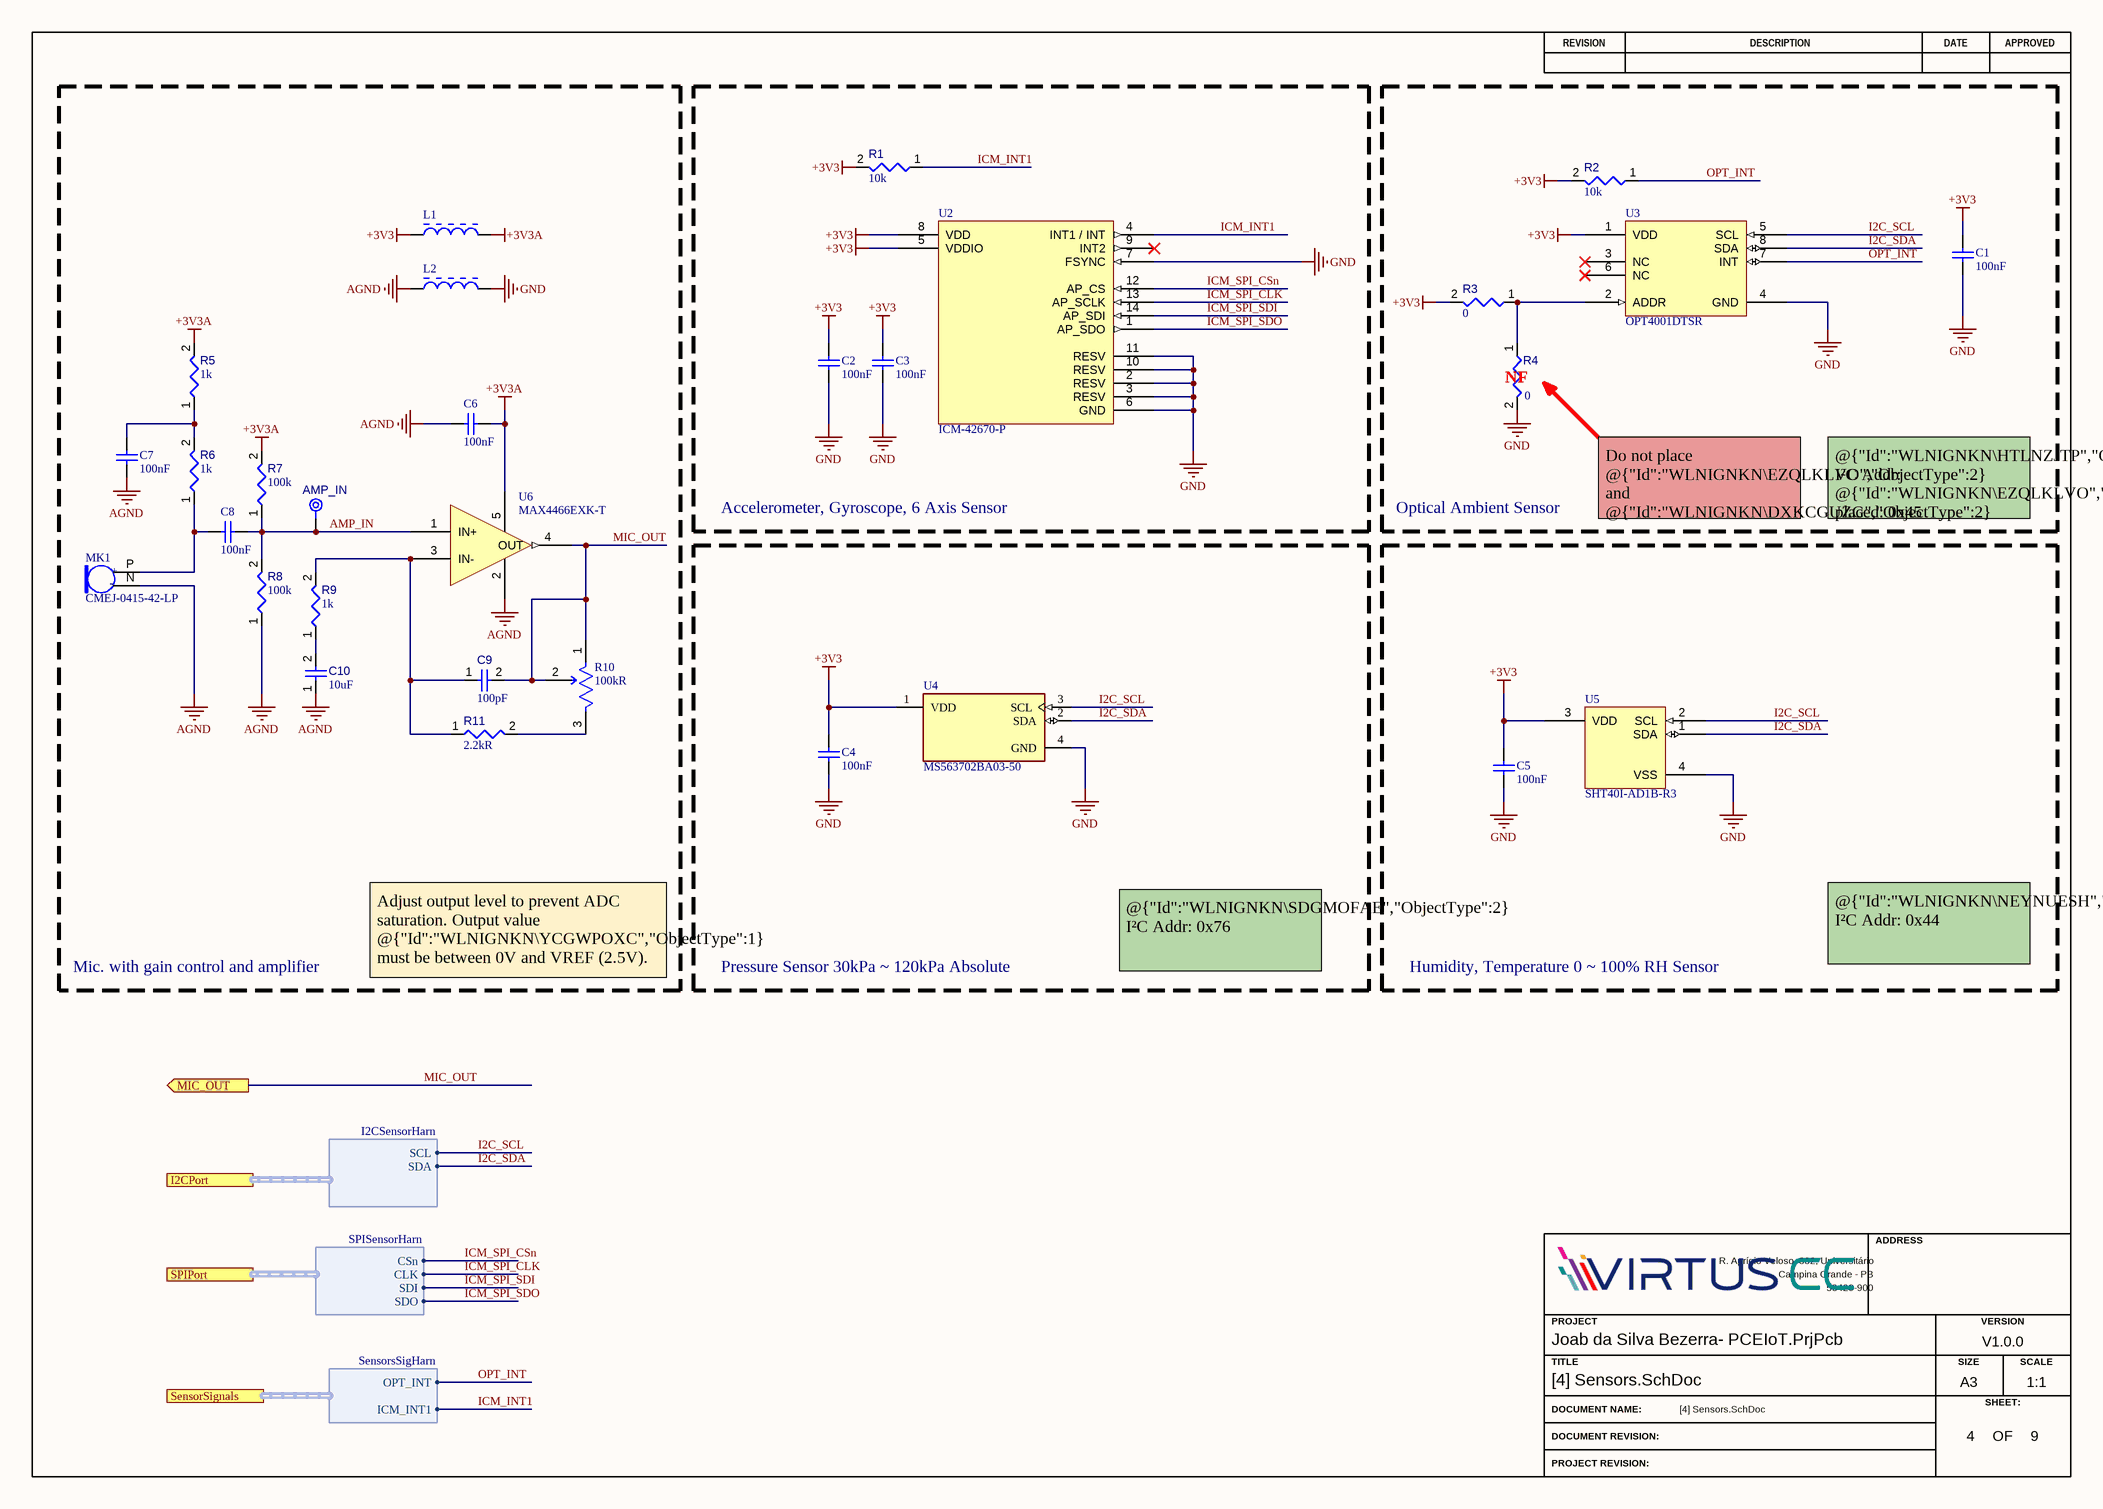
[diagram p5: [4] Sensors.SchDoc]

### Parts
AMP_IN  TPAD6R  [TP06R]  (value not drawn)  (no BOM)
C1  value 100nF  [CAPC0603(1608)100_L]  (hidden comment: VJ0603Y104MXJCW1BC)
C2  value 100nF  [CAPC0603(1608)100_L]  (hidden comment: VJ0603Y104MXJCW1BC)
C3  value 100nF  [CAPC0603(1608)100_L]  (hidden comment: VJ0603Y104MXJCW1BC)
C4  value 100nF  [CAPC0603(1608)100_L]  (hidden comment: VJ0603Y104MXJCW1BC)
C5  value 100nF  [CAPC0603(1608)100_L]  (hidden comment: VJ0603Y104MXJCW1BC)
C6  value 100nF  [CAPC0603(1608)100_L]  (hidden comment: VJ0603Y104MXJCW1BC)
C7  value 100nF  [CAPC0603(1608)100_L]  (hidden comment: VJ0603Y104MXJCW1BC)
C8  value 100nF  [CAPC0603(1608)100_L]  (hidden comment: VJ0603Y104MXJCW1BC)
C9  value 100pF  [CAPC0603(1608)100_L]  (hidden comment: C0603C101K5GACTU)
C10  value 10uF  [CAPC0603(1608)100_L]  (hidden comment: GRM188R60J106ME47D)
L1  BLM21PG331SN1D  [INDC2013X105X50ML20T20]  (value not drawn)
L2  BLM21PG331SN1D  [INDC2013X105X50ML20T20]  (value not drawn)
MK1  CMEJ-0415-42-LP  [MIC_CMEJ-0415-42-LP]
R1  value 10k  [RESC0603(1608)_L]  (hidden comment: Resistor 10k +/-1% 0603 100 mW)
R2  value 10k  [RESC0603(1608)_L]  (hidden comment: Resistor 10k +/-1% 0603 100 mW)
R3  value 0  [RESC0603(1608)_L]  (hidden comment: Resistor 0R +/- 5% 0603 100 mW)
R4  value 0  [RESC0603(1608)_L]  (hidden comment: Resistor 0R +/- 5% 0603 100 mW)
R5  value 1k  [RESC0603(1608)_L]  (hidden comment: Resistor 1k +/-1% 0603 100 mW)
R6  value 1k  [RESC0603(1608)_L]  (hidden comment: Resistor 1k +/-1% 0603 100 mW)
R7  value 100k  [RESC0603(1608)_L]  (hidden comment: Resistor 100k +/-1% 0603 100 mW)
R8  value 100k  [RESC0603(1608)_L]  (hidden comment: Resistor 100k +/-1% 0603 100 mW)
R9  value 1k  [RESC0603(1608)_L]  (hidden comment: Resistor 1k +/-1% 0603 100 mW)
R10  value 100kR  [FP-TC33X-2-MFG]  (hidden comment: TC33X-2-104E)
R11  value 2.2kR  [RESC0603(1608)_L]  (hidden comment: CRCW06032K20FKEA)
U2  ICM-42670-P  [QFN50P300X250X81-14N]
U3  OPT4001DTSR  [SON50P130X60-8N]
U4  MS563702BA03-50  [FP-MS563702BA03-50-MFG]
U5  SHT40I-AD1B-R3  [QFN80P150X150X55-4N]
U6  MAX4466EXK-T  [SOT65P200X110-5N]

### Blocks framed on the sheet
Mic. with gain control and amplifier: AMP_IN C6-C10 L1 L2 MK1 R5-R11 U6
Accelerometer, Gyroscope, 6 Axis Sensor: C2 C3 R1 U2
Pressure Sensor 30kPa ~ 120kPa Absolute: C4 U4
Humidity, Temperature 0 ~ 100% RH Sensor: C5 U5

### Ports
I2CPort (harness I2CSensorHarn, see [3] TopLevel[7A]), MIC_OUT (out, see [3] TopLevel[7B]), SensorSignals (harness SensorsSigHarn, see [3] TopLevel[6A]), SPIPort (harness SPISensorHarn, see [3] TopLevel[6B])

### Harnesses
I2CSensorHarn: SCL, SDA
SPISensorHarn: CSn, CLK, SDI, SDO
SensorsSigHarn: OPT_INT, ICM_INT1

### Nets
+3V3: C1.1 C2.1 C3.1 C4.2 C5.2 L1.1 R1.2 R2.2 R3.2 U2.5(VDDIO) U2.8(VDD) U3.1(VDD) U4.1(VDD) U5.3(VDD)
+3V3A: C6.2 L1.2 R5.2 R7.2 U6.5(VCC)
AGND: C6.1 C7.1 C10.1 L2.1 MK1.N(GND) R8.1 U6.2(GND)
GND: C1.2 C2.2 C3.2 C4.1 C5.1 L2.2 R4.2 U2.2(RESV) U2.3(RESV) U2.6(GND) U2.7(FSYNC) U2.10(RESV) U2.11(RESV) U3.4(GND) U4.4(GND) U5.4(VSS)
AMP_IN: AMP_IN.1(TP) C8.2 R7.1 R8.2 U6.1(IN+)
I2C_SCL: U3.5(SCL) U4.3(SCL) U5.2(SCL) ; port I2CPort.SCL  [project net GP5/I2C0_SCL]
I2C_SDA: U3.8(SDA) U4.2(SDA) U5.1(SDA) ; port I2CPort.SDA  [project net GP4/I2C0_SDA]
ICM_INT1: R1.1 U2.4(INT1_/_INT) ; port SensorSignals.ICM_INT1  [project net GP12/ICM_INT1]
ICM_SPI_CLK: U2.13(AP_SCLK) ; port SPIPort.CLK  [project net GP18/SPI0_SCK]
ICM_SPI_CSn: U2.12(AP_CS) ; port SPIPort.CSn  [project net GP10/MOT_CSn]
ICM_SPI_SDI: U2.14(AP_SDI) ; port SPIPort.SDI  [project net GP19/SPI0_TX]
ICM_SPI_SDO: U2.1(AP_SDO) ; port SPIPort.SDO  [project net GP16/SPI0_RX]
MIC_OUT: C9.2 R10.1(CCW) R10.2(WIPER) U6.4(OUT) ; port MIC_OUT
OPT_INT: R2.1 U3.7(INT) ; port SensorSignals.OPT_INT  [project net GP13/OPT_INT]
NetC7_2: C7.2 R5.1 R6.2
NetC8_1: C8.1 MK1.P(OUTPUT) R6.1
NetC9_1: C9.1 R9.2 R11.1 U6.3(IN-)
NetC10_2: C10.2 R9.1
NetR3_1: R3.1 R4.1 U3.2(ADDR)
NetR10_3: R10.3(CW) R11.2

Not connected (* = marked no-connect by the designer): U2 9(INT2)*; U3 3(NC)* 6(NC)*

### Notes on the sheet
- (near R4) NF
- Optical Ambient Sensor
- Do not place @{"Id":"WLNIGNKN\EZQLKLVO","ObjectType":2} and @{"Id":"WLNIGNKN\DXKCGUZG","ObjectType":2}  simultaneously
- @{"Id":"WLNIGNKN\HTLNZJTP","ObjectType":2} I²C Addr:
  @{"Id":"WLNIGNKN\EZQLKLVO","ObjectType":2} placed: 0x45
  @{"Id":"WLNIGNKN\DXKCGUZG","ObjectType":2} placed: 0x44
- Adjust output level to prevent ADC saturation. Output value @{"Id":"WLNIGNKN\YCGWPOXC","ObjectType":1} must be between 0V and VREF (2.5V).
- @{"Id":"WLNIGNKN\SDGMOFAE","ObjectType":2}  I²C Addr: 0x76
- @{"Id":"WLNIGNKN\NEYNUESH","ObjectType":2}  I²C Addr: 0x44
- REVISION
- DESCRIPTION
- DATE
- APPROVED
- ADDRESS
- PROJECT
- VERSION
- TITLE
- A3
- SIZE
- SCALE
- DOCUMENT NAME:
- DOCUMENT REVISION:
- OF
- SHEET:
- PROJECT REVISION:
- (in symbol CMP-010-000001-2) +; -

### Library data of the parts
AMP_IN = CMP-00028-00002-2: 0.6mm round; Pins: 1
C1-C8 = CMP-001-00085-1: as C27 on sheet [7] PowerManagement; Packaging: Tape and Reel; Min Operating Temperature: -55°C; Case/Package: 0603; Length: 1.6mm; Termination: SMD/SMT; Height: 0.95mm; Mounting Technology: Surface Mount; Width: 0.8mm; Case Code (Imperial): 0603; Construction: Flat; Lead Free: Lead Free; Package Quantity: 4000; Max Operating Temperature: 125°C; Dielectric: X7R; RoHS Compliant: Yes; Depth: 0.8mm; Tolerance: 20%; Series: VJ; Case Code (Metric): 1608; Voltage Rating (DC): 16V
C9 = CMP-001-00088-1: Multilayer Ceramic Capacitor, 100 pF, 50 V, ï¿½ 10%, C0G (NP0), 0603 [1608 Metric]; Dissipation Factor: 0.1%; Voltage Rating: 50V; Temperature Coefficient: 30ppm/°C; Min Operating Temperature: -55°C; Dielectric Material: Ceramic; Case/Package: 0603; Depth: 0.8mm; Mounting Technology: Surface Mount,PCB; Tolerance: 10%; Dielectric: C0G; Case Code (Metric): 1608; Height: 0.8mm; RoHS Compliant: Yes; Termination: SMD/SMT; Max Operating Temperature: 125°C; Length: 1.6mm; Packaging: Tape and Reel; Radiation Hardening: No; Voltage Rating (DC): 50V; Package Quantity: 1; Lead Free: Lead Free; Construction: Flat; Lead Pitch: 0.7mm; Series: C; Thickness: 0.034inch; Reach SVHC Compliant: No; Width: 0.031inch; Material: Ceramic; Case Code (Imperial): 0603
C10 = CMP-001-00087-1: Multilayer Ceramic Capacitor, 10 uF, 6.3 V, ± 20%, X5R, 0603 [1608 Metric]; Voltage Rating: 6.3V; Case/Package: 0603; Series: GRM; Mounting Technology: Surface Mount; RoHS Compliant: Yes; Package Quantity: 4000; Case Code (Metric): 1608; Dielectric: X5R; Weight: 0.000222oz; Max Operating Temperature: 85°C; Width: 0.8mm; Termination: Standard; Height: 0.8mm; Tolerance: 20%; Voltage Rating (DC): 6.3V; Length: 1.6mm; Min Operating Temperature: -55°C; Packaging: Cut Tape; Lead Free: Lead Free; Case Code (Imperial): 0603
L1 L2 = CMP-006-00000-4: IND, Chip Ferrite Bead, 330 Ohm, +/- 25%, 1.5 A, -55 to 125 degC, 0805 (2012 Metric), Tape and Reel; Manufacturer: Murata; Impedance: 330Ohm; Current Rating: 1.5A; Resistance: 90mohm; Min Operating Temperature: -55°C; Datasheet Version: Nov-11; Package Quantity: 4000; Datasheet URL: http://psearch.en.murata.com/inductor/product/LQG15HS15NJ02_.pdf; Core Material: Ferrite; Mounting Technology: SM; Package Reference: 0805; Max Current Rating: 1.5A; RoHS Compliant: True; Tolerance: 25%; Max Operating Temperature: 125°C; Package Description: 2-Pin Surface Mount Device, Body 2 x1.25 mm; Case/Package: 0805; Packaging: TapeandReel
MK1 = CMP-010-000001-2: 4.0 mm, Omnidirectional, PCB Mount, 2.0 Vdc, Elecret Condenser Microphone; Frequency: 100Hz; Shape: Circular; Operating Supply Current: 500uA; Voltage Rating: 2V; Output Type: Analog; Clock Frequency: 10kHz; MF: {'manufacturer': u'CUI'}; Value: *; Termination: PC Pins; Availability: Unavailable; Width: 4mm; Design Item ID: CMEJ-0415-42-LP; Series: CMEJ; Direction: Omnidirectional; Pin Count: 2; Price: None; Component Type: Standard; Package: None; MP: CMEJ-0415-42-LP; Operating Supply Voltage: 2V; Length: 4mm; Height: 1.5mm; Source: CMEJ-0415-42-LP.SchLib
R1 R2 = CMP-009-00017-7: as R29 on sheet [3] TopLevel; Mounting Technology: SM; Max Operating Temperature: 155°C; Case/Package: 0603; Tolerance: 1%; RoHS Compliant: True; Pins: 2; Min Operating Temperature: -55°C
R3 R4 = CMP-009-00006-6: as R32 on sheet [3] TopLevel; Tolerance: 5%; Mounting Technology: SM; RoHS Compliant: True; Max Operating Temperature: 155°C; Min Operating Temperature: -55°C; Case/Package: 0603; Pins: 2
R5 R6 R9 = CMP-009-00014-6: as R33 on sheet [3] TopLevel; Mounting Technology: SM; Case/Package: 0603; Min Operating Temperature: -55°C; RoHS Compliant: True; Max Operating Temperature: 155°C; Pins: 2
R7 R8 = CMP-009-00023-6: Chip Resistor, 100 KOhm, +/- 1%, 0.1 W, -55 to 155 degC, 0603 (1608 Metric); Power: 100mW; Voltage Rating: 50V; Tolerance: 1%; RoHS Compliant: True; Pins: 2; Min Operating Temperature: -55°C; Case/Package: 0603; Max Operating Temperature: 155°C; Mounting Technology: SM
R10 = CMP-009-00187-1: Cermet trimmer potentiometer, 100 kΩ, 0.1 W, SMD, on top, TC33X-2-104E; Resistance Tolerance: 25%; Voltage Rating (DC): 50V; Power Rating: 100mW; Temperature Coefficient: 250ppm/°C; Number of Turns: 1; Mounting Technology: Surface Mount; Pins: 2; Resistor Type: Carbon,Cermet; Tolerance: 25%; Min Operating Temperature: -40°C; Radiation Hardening: No; Length: 0.15inch; Max Operating Temperature: 100°C; Height: 0.047inch; RoHS Compliant: Yes; Max Power Dissipation: 100mW; Depth: 3.8mm; Reach SVHC Compliant: No; Military Standard: Not; Series: TC33; Width: 0.118inch; Weight: 29.4mg; Termination: Foot Print; Package Quantity: 1; Packaging: Tape and Reel
R11 = CMP-009-00186-1: as R39 on sheet [7] PowerManagement; Depth: 0.85mm; Height: 0.45mm; Contact Plating: Tin; Resistance Tolerance: 1%; Ratings: AEC-Q200; Weight: 7.1E-05oz; Series: CRCW; Case Code (Imperial): 0603; Construction: Rectangular; Width: 0.033inch; Reach SVHC Compliant: Unknown; Case Code (Metric): 1608; Resistor Type: Thick Film; Packaging: Tape and Reel; Case/Package: 0603; Package Quantity: 10; RoHS Compliant: Yes; Lead Free: Lead Free; Military Standard: Not; Termination: SMD/SMT; Tolerance: 1%; Technology: THICK FILM; Max Operating Temperature: 155°C; Voltage Rating: 75V; Power Rating: 100mW; Length: 1.55mm; Number of Terminations: 2; Radiation Hardening: No; Min Operating Temperature: -55°C; Features: Automotive AEC-Q200
U2 = CMP-010-00032-3: Mems Module, 1.71-3.6 V, Lga-14 Rohs Compliant: Yes; Width: 3mm; Length: 2.5mm; Min Operating Temperature: -40°C
U3 = CMP-010-00031-2: High-speed high-precision digital ambient light sensor (ALS) 8-SOT-5X3 -40 to 85; Length: 2.1mm; Height: 600um; Width: 1.2mm; Thickness: 550um; Pins: 8
U4 = CMP-010-00027-2: Pressure Sensor, Barometric, 300 mbar, 1200 mbar, QFN, 8, -40 C; Min Supply Voltage: 1.8V; Max Supply Voltage: 3.6V; Supply Current: 20.09uA; Pins: 8; Packaging: Cut Tape; Min Operating Temperature: -40°C; Lead Free: Lead Free; RoHS Compliant: Yes; Height: 1mm; Max Operating Temperature: 85°C; Reach SVHC Compliant: No; Pressure Type: Barometric; Case/Package: QFN
U5 = CMP-010-00033-3: Humidity And Temperature Sensor
U6 = CMP-00027-00002-4: Audio Amp Microphone 1-CH Mono Class-AB 5-Pin SC-70 T/R; Max Supply Voltage: 5.5V; Min Supply Voltage: 2.4V; Gain Bandwidth Product: 600kHz; Power Supply Rejection Ratio (PSRR): 112dB; RoHS Compliant: No; Radiation Hardening: No; Series: -; Packaging: Tape and Reel; Mounting Technology: Surface Mount; Max Operating Temperature: 85°C; Min Operating Temperature: -40°C